# Altium project Relay Board.PrjPcb
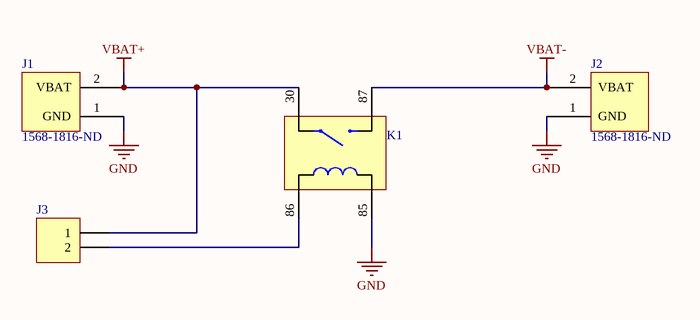
[diagram p0: Relay Board Schematic.SchDoc]
1 sheet, 4 parts. Net scope: global (net labels, ports and power ports of the same name join across sheets).
Board file: Relay Board PCB.PcbDoc

## Sheet Relay Board Schematic.SchDoc
size A4; SheetNumber: 1; SheetTotal: 1

### Parts
J1  Supplier Part Number 1: 1568-1816-ND  [XT60_CONN]  (hidden comment: CONN_XT60)
J2  Supplier Part Number 1: 1568-1816-ND  [XT60_CONN]  (hidden comment: CONN_XT60)
J3  CONN_HDR_1X2  [HDR1X2]  (value not drawn)
K1  RLY_ELO_MINI_POWER_RELAY_24V_70A  [ELO_MINI_POWER_RELAY]  (value not drawn)

### Nets
GND: J1.1(GND) J2.1(GND) K1.85
VBAT+: J1.2(VBAT) J3.1 K1.30
VBAT-: J2.2(VBAT) K1.87
NetJ3_2: J3.2 K1.86

### Library data of the parts
J1 J2 = CONN_XT60: XT60 Connectors Male/female Pair; Manufacturer: SparkFun; Manufacturer Part Number: PRT-10474; Supplier 1: Digi-Key; RoHS: No; Stock 1: 2196; Pricing 1: 1=1,50000 (USD); ComponentLink1URL: https://cdn.sparkfun.com/datasheets/Prototyping/xt60.pdf?src-supplier=Digi-Key; ComponentLink1Description: https://cdn.sparkfun.com/datasheets/Prototyping/xt60.pdf?src-supplier=Digi-Key
J3 = CONN_HDR_1X2: Header, 2-Pin; LatestRevisionDate: 17-Jul-2002; LatestRevisionNote: Re-released for DXP Platform.; Publisher: Altium Limited